# EAGLE design class_d_amplifier (EAGLE 9.6.2)
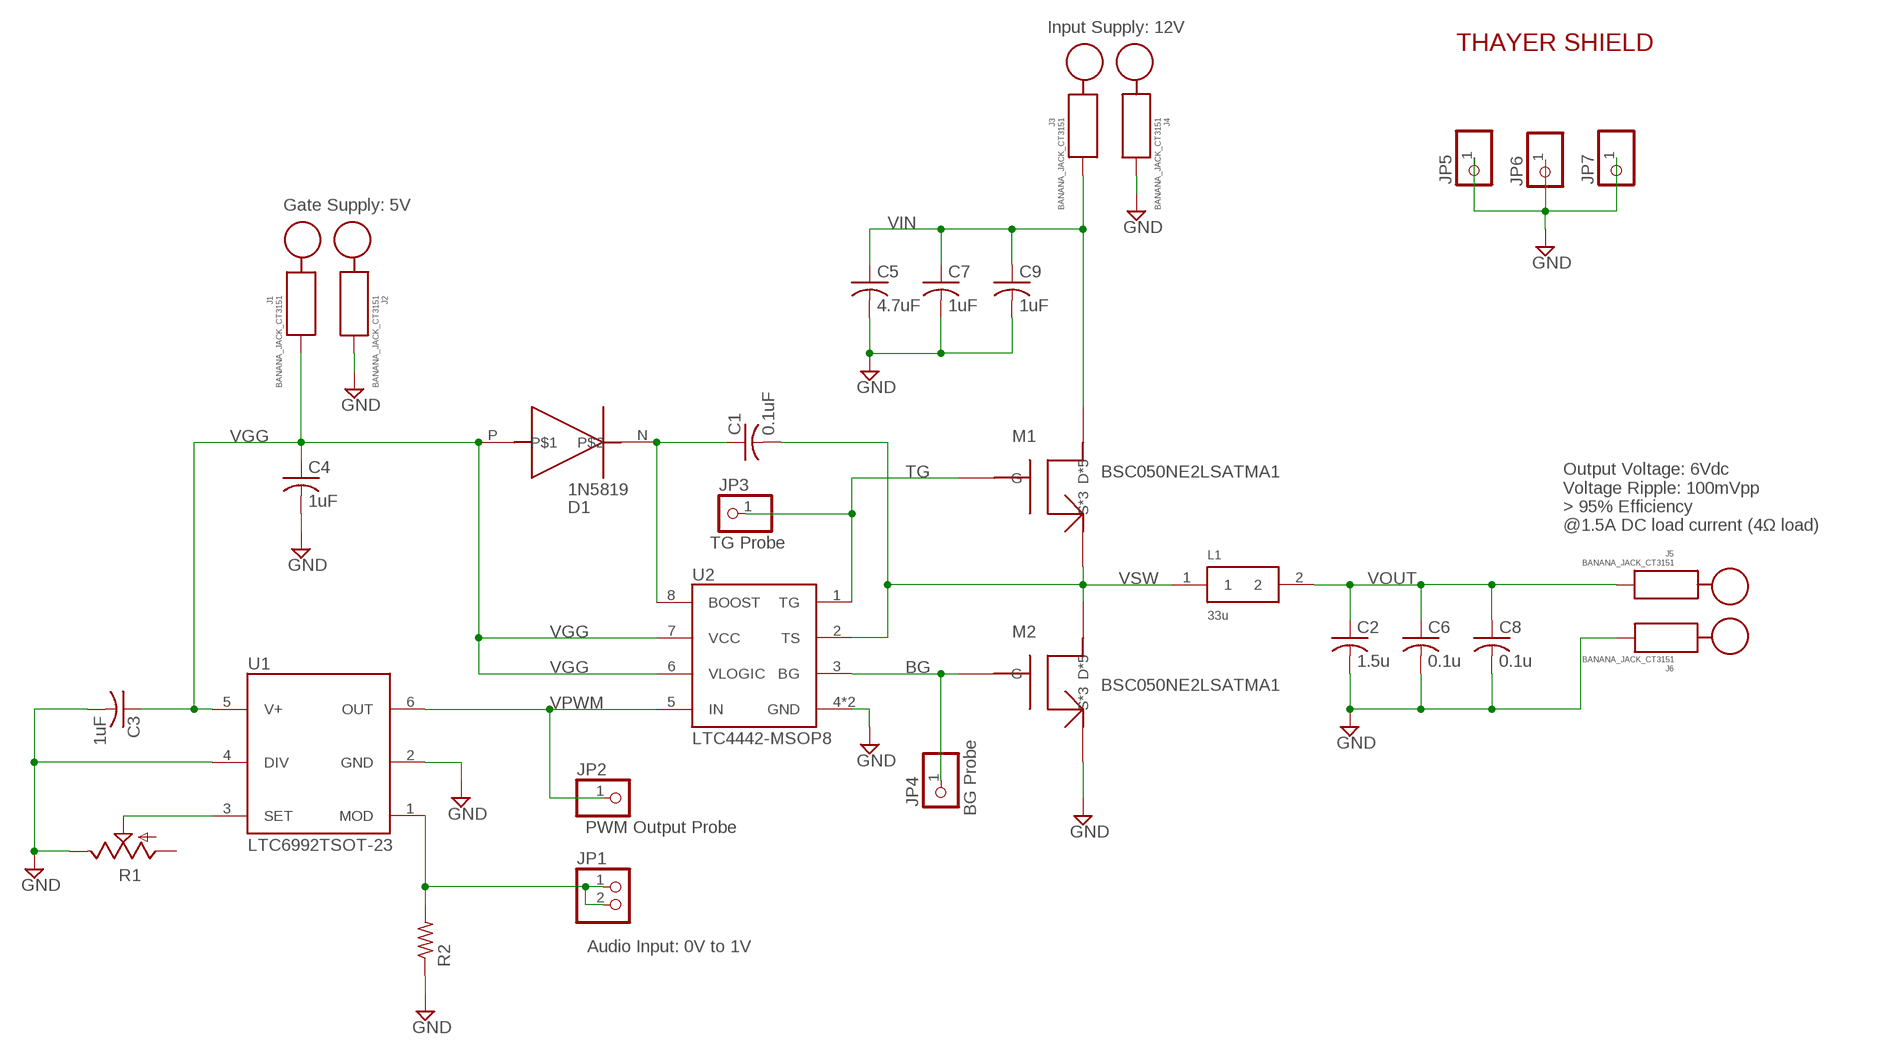
[diagram p0: schematic, sheet 1]

## Parts
C1  0.1uF  C-US  [C0805]
C2  1.5u  C-USC1206  [C1206]
C3  1uF  C-US  [C0805]
C4  1uF  C-US  [C0805]
C5  4.7uF  C-USC1206  [C1206]
C6  0.1u  C-US  [C0805]
C7  1uF  C-US  [C0805]
C8  0.1u  C-US  [C0805]
C9  1uF  C-US  [C0805]
D1  1N5819  DIODE  [SOD123]
J1  BANANA_JACK_CT3151  [CT3151SP2_PCB_MOUNT]
J2  BANANA_JACK_CT3151  [CT3151SP2_PCB_MOUNT]
J3  BANANA_JACK_CT3151  [CT3151SP2_PCB_MOUNT]
J4  BANANA_JACK_CT3151  [CT3151SP2_PCB_MOUNT]
J5  BANANA_JACK_CT3151  [CT3151SP2_PCB_MOUNT]
J6  BANANA_JACK_CT3151  [CT3151SP2_PCB_MOUNT]
JP1  PINHD-1X2  [1X02]
JP2  PINHD-1X1  [1X01]
JP3  PINHD-1X1  [1X01]
JP4  PINHD-1X1  [1X01]
JP5  PINHD-1X1  [1X01]
JP6  PINHD-1X1  [1X01]
JP7  PINHD-1X1  [1X01]
L1  33u  SER2900SER  [SER2900]
M1  BSC050NE2LSATMA1  [PD-TDSON-8]
M2  BSC050NE2LSATMA1  [PD-TDSON-8]
R1  TRIM_US-CT6  [CT6]
R2  R-US  [R0805]
U1  LTC6992TSOT-23  [TSOT23-6]
U2  LTC4442-MSOP8  LTC4442  [LTC4442]
U$1  THAYER  [THAYER]

## Nets
BG: JP4.1 M2.4(G) U2.3(BG)
BOOST: C1.1 D1.N U2.8(BOOST)
GND: C2.2 C3.2 C4.2 C5.2 C6.2 C7.2 C8.2 C9.2 J2.P$1(IN) J2.P$2(IN) J2.P$3(IN) J2.P$4(IN) J4.P$1(IN) J4.P$2(IN) J4.P$3(IN) J4.P$4(IN) J6.P$1(IN) J6.P$2(IN) J6.P$3(IN) J6.P$4(IN) JP5.1 JP6.1 JP7.1 M2.1(S*3) M2.2(S*3) M2.3(S*3) R1.E R2.1 U1.2(GND) U1.4(DIV) U2.4(GND) U2.9(GND)
N$1: R1.S U1.3(SET)
N$4: JP1.1 JP1.2 R2.2 U1.1(MOD)
TG: JP3.1 M1.4(G) U2.1(TG)
VGG: C3.1 C4.1 D1.P J1.P$1(IN) J1.P$2(IN) J1.P$3(IN) J1.P$4(IN) U1.5(V+) U2.6(VLOGIC) U2.7(VCC)
VIN: C5.1 C7.1 C9.1 J3.P$1(IN) J3.P$2(IN) J3.P$3(IN) J3.P$4(IN) M1.5(D*5) M1.6(D*5) M1.7(D*5) M1.8(D*5) M1.9(D*5)
VOUT: C2.1 C6.1 C8.1 J5.P$1(IN) J5.P$2(IN) J5.P$3(IN) J5.P$4(IN) L1.2
VPWM: JP2.1 U1.6(OUT) U2.5(IN)
VSW: C1.2 L1.1 M1.1(S*3) M1.2(S*3) M1.3(S*3) M2.5(D*5) M2.6(D*5) M2.7(D*5) M2.8(D*5) M2.9(D*5) U2.2(TS)
Unconnected: R1.A

## Notes on the sheet
- Input Supply: 12V
- Gate Supply: 5V
- Output Voltage: 6Vdc
  Voltage Ripple: 100mVpp
  > 95% Efficiency 
  @1.5A DC load current (4Ω load)
- TG Probe
- BG Probe
- PWM Output Probe
- Audio Input: 0V to 1V

## Library data of the parts
C1 C3 C4 C6-C9 = Engs125_library:C-US: 0805 capacitor footprint.
C2 C5 = rcl:C-US: CAPACITOR, American symbol; SPICEPREFIX: C
D1 = Engs125_library:DIODE: Diode with SOD123 package.
J1-J6 = Engs125_lib_UPDATEFeb22:BANANA_JACK_CT3151: This is a PCB mount banana jack for package CT3151SP-2
JP1 = Engs125_lib_UPDATEFeb22:PINHD-1X2: PIN HEADER
JP2-JP7 = Engs125_lib_UPDATEFeb22:PINHD-1X1: PIN HEADER
L1 = Engs125_library:SER2900: Inductor SER2900: http://www.coilcraft.com/ser2900.cfm
M1 M2 = Engs125_lib_NEW_UPDATE_USE_THIS_V2:BSC050NE2LSATMA1
R1 = Engs125_lib_UPDATEFeb22:TRIM_US-: POTENTIOMETER
R2 = Engs125_lib_UPDATEFeb22:R-US
U1 = Engs125_lib_UPDATEFeb22:LTC6992: LTC6992 is a silicon oscillator with an easy-to-use analog voltage-controlled pulse width modulation (PWM) capability.
U2 = Engs125_lib_NEW_UPDATE_USE_THIS_V2:LTC4442: LTC4442 (LTC4442-1) Synchronous N-channel Gate Driver Vcc = 6V - 9.5V Vin max = 38V
U$1 = Engs125_lib_UPDATEFeb22_with_logo:THAYER

## Board
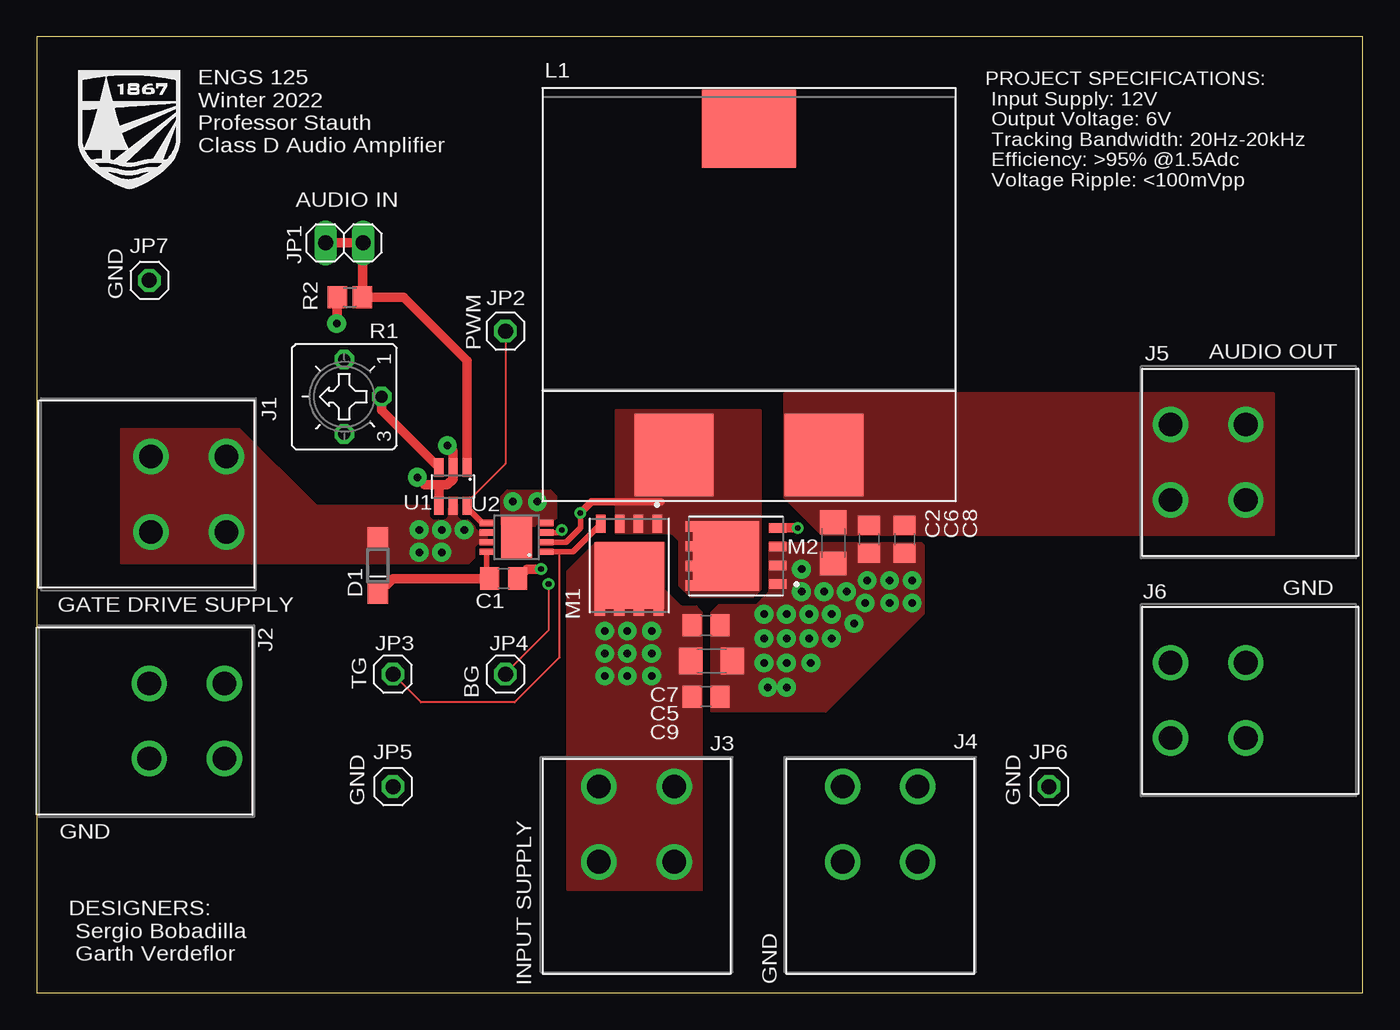
[diagram p1: board, top side]
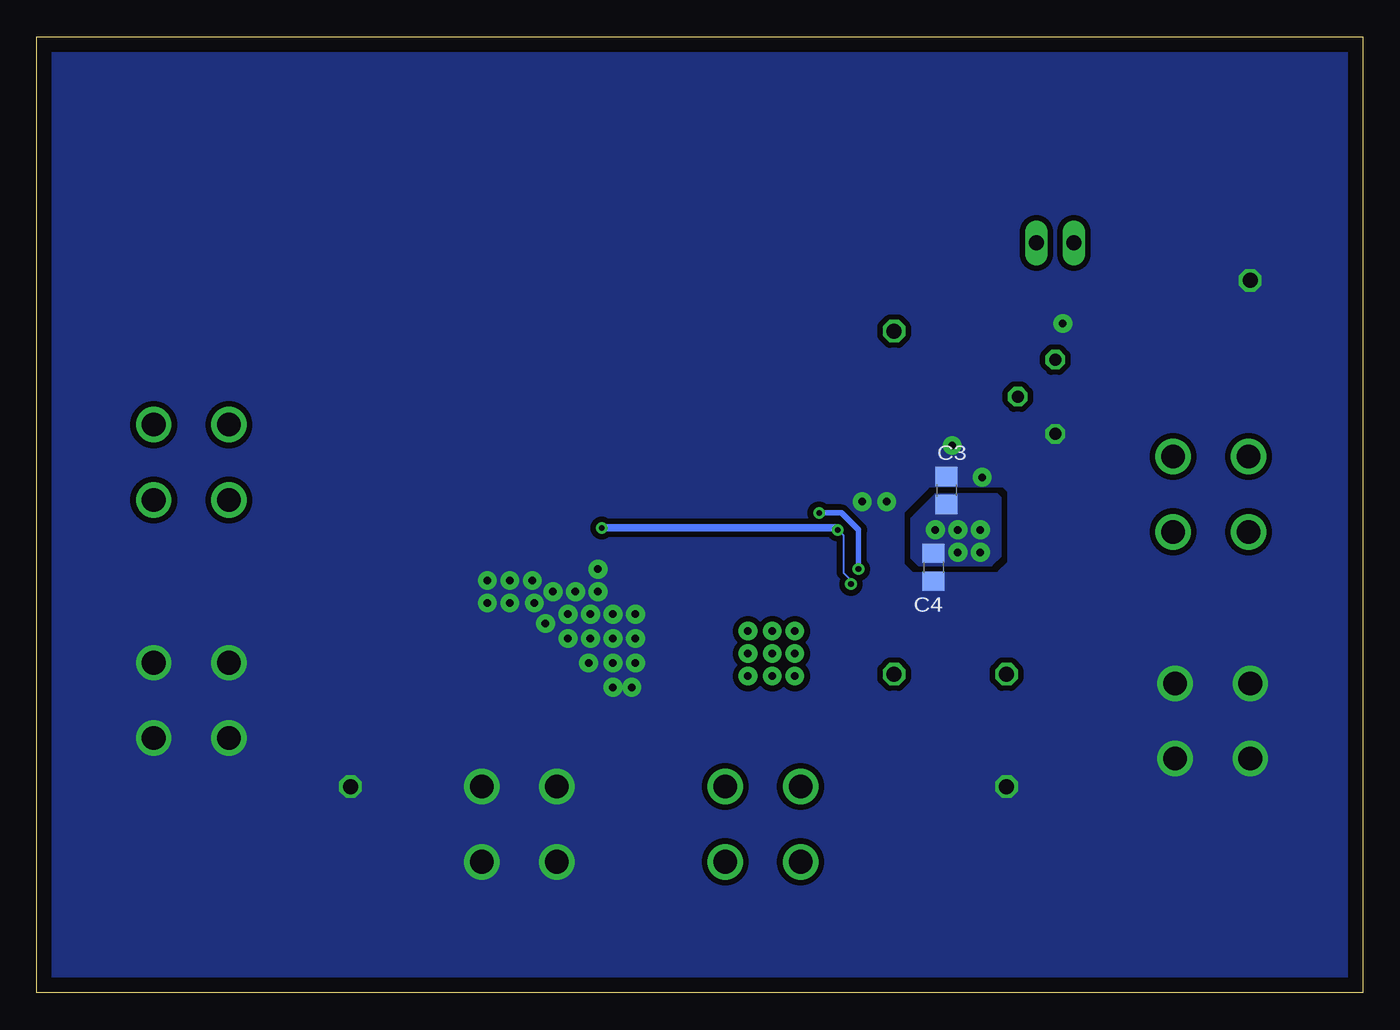
[diagram p2: board, bottom side, seen from below]

Size 89.84 x 64.76 mm. Coordinates in mm from the lower left corner, seen from the top.
Outline: 0,0 89.84,0 89.84,64.76 0,64.76 0,0
Copper layers (1*16): Top 0.035mm / dielectric 1.5mm / Bottom 0.035mm
Design rules "default *": minimum track width 6mil, minimum drill 15mil, track to track 6mil, track to pad 6mil, pad to pad 6mil, via to via 6mil, smd to smd 6mil, copper to edge 40mil, drill to drill 15mil, minimum pad ring 10mil, minimum via ring 8mil, stop-mask expansion 4mil, vias tented up to drill 0mil, thermal gap 10mil

### Footprints (pad centres in the part's own frame; a part is rotated, then mirrored left to right if it is on the bottom)
C0805 = smd 1.3 x 1.5: 1 -0.95,0; 2 0.95,0
C1206 = smd 1.6 x 1.8: 1 -1.4,0; 2 1.4,0
SOD123 = smd 1.4 x 1.4: N 1.9,0; P -1.9,0
CT3151SP2_PCB_MOUNT = drill 1.6: P$1 2.55,2.55; P$2 2.55,-2.55; P$3 -2.55,-2.55; P$4 -2.55,2.55
1X02 = drill 1.016 long: 1 -1.27,0; 2 1.27,0
1X01 = drill 1.016 octagon: 1 0,0
SER2900 = smd 5.334 x 5.588: 1 -5.08,-14.351; 2 5.08,-14.351 | smd 6.35 x 5.283: EXTRA 0,7.722
PD-TDSON-8 = smd 1.2 x 0.65: 1 -2.825,1.905; 2 -2.825,0.635; 3 -2.825,-0.635; 4 -2.825,-1.905 | smd 0.5 x 0.7: 5 3.175,-1.995; 6 3.175,-0.665; 7 3.175,0.665; 8 3.175,1.995 | smd 4.5 x 4.7: 9 0.675,0
CT6 = drill 0.813 octagon: A 2.515,0; E -2.515,0; S 0,-2.54
R0805 = smd 1.3 x 1.5: 1 -0.85,0; 2 0.85,0
TSOT23-6 = smd 0.62 x 1.22: 1 -0.95,-1.3; 2 0,-1.3; 3 0.95,-1.3; 4 0.95,1.3; 5 0,1.3; 6 -0.95,1.3
LTC4442 = smd 0.42 x 0.9: 1 -0.975,-2.05; 2 -0.325,-2.05; 3 0.325,-2.05; 4 0.975,-2.05; 5 0.975,2.05; 6 0.325,2.05; 7 -0.325,2.05; 8 -0.975,2.05 | smd 2.794 x 2.083: 9 0,0

### Placement (x,y rotation side)
C1  31.62,28.07 0 top
C2  53.98,30.48 270 top
C3  28.19,34.04 90 bottom
C4  29.08,28.83 270 bottom
C5  45.72,22.48 0 top
C6  56.39,30.73 270 top
C7  45.34,24.89 0 top
C8  58.8,30.73 270 top
C9  45.34,20.07 0 top
D1  23.11,28.96 270 top
J1  10.29,33.78 0 top
J2  10.16,18.41 0 top
J3  40.64,11.43 90 top
J4  57.15,11.43 90 top
J5  79.38,35.94 180 top
J6  79.38,19.81 180 top
JP1  20.83,50.8 180 top
JP2  31.75,44.83 0 top
JP3  24.13,21.59 180 top
JP4  31.75,21.59 0 top
JP5  24.13,13.97 0 top
JP6  68.58,13.97 0 top
JP7  7.62,48.26 0 top
L1  48.26,50.8 0 top
M1  40.13,28.96 270 top
M2  47.37,29.59 180 top
R1  20.83,40.39 90 top
R2  21.21,47.12 0 top
U1  28.19,34.29 180 top
U2  32.51,30.86 90 top
U$1  2.79,54.48 0 top

### Tracks (layer width: path | path; a pad name or v marks a point on that pad's centre or on a via)
BG  (via drill 0.38, 0.38 pad 0.76)
  Top 0.152: JP4.1 31.75,21.64 34.67,24.56 v34.67,27.69
  Top 0.381: U2.3 35.38,31.19 v35.56,31.37
  Top 0.635: M2.4 v51.56,31.5
  Bottom 0.152: v35.56,31.37 35.18,30.99 35.18,28.45 34.67,27.94 v34.67,27.69
  Bottom 0.508: v51.56,31.5 35.69,31.5 v35.56,31.37
BOOST
  Top 0.381: U2.8 30.46,28.28 C1.1
  Top 0.635: C1.1 24.12,28.07 D1.N
GND  (via drill 0.51 pad 1.27)
  Top 0.635: R2.1 20.36,45.38 v20.32,45.34 | 27.3,34.42 27.81,34.42 28.19,34.8 U1.2 28.19,36.7 v27.81,37.08 | 27.3,34.42 26.29,34.42 v25.78,34.92 | U1.4 27.24,34.36 27.3,34.42
  other vias: 59.31,27.94 57.78,27.94 56.26,27.94 51.82,28.7 59.31,26.42 57.78,26.42 56.13,26.42 54.86,27.18 50.8,22.35 49.28,22.35 50.8,24 49.28,24 50.8,25.65 49.28,25.65 53.34,27.18 52.32,25.65 53.85,25.65 51.82,27.18 50.8,20.7 49.53,20.7 52.32,24 53.85,24 52.45,22.35 55.37,25.02 32.26,33.27 33.91,33.27
  pour Top (isolate 0.381, no thermals): 60.07,30.35 60.07,25.65 53.47,19.05 45.72,19.05 45.72,25.78 46.23,26.29 48.77,26.29 49.66,27.18 49.66,30.48 59.94,30.48
  pour Bottom (isolate 0.381, rank 2, no thermals): 0,64.77 89.92,64.77 89.92,0 0,0
  pour Top (isolate 0.381, no thermals): 31.5,31.75 31.5,33.66 31.88,34.04 34.8,34.04 35.18,33.66 35.18,31.88 34.92,31.62 31.62,31.62
N$1
  Top 0.635: U1.3 23.37,39.47 R1.S
N$4
  Top 0.635: U1.1 29.14,42.83 24.86,47.12 R2.2 22.06,50.76 JP1.1 JP1.2
TG
  Top 0.152: JP3.1 26.04,19.68 32.38,19.68 35.43,22.73 35.43,29.89
  Top 0.381: U2.1 35.43,29.89 36.33,29.89
  Top 0.406: 36.33,29.89 M1.4
VGG  (via drill 0.51 pad 1.27)
  other vias: 25.91,31.37 28.96,31.37 27.43,31.37 25.91,29.84 27.43,29.84
  pour Top (isolate 0.305, no thermals): 5.71,29.08 5.71,38.23 13.72,38.23 18.92,33.02 30.48,33.02 30.48,30.35 29.21,29.08
  pour Bottom (isolate 0.305, no thermals): 24.51,29.59 24.51,33.53 24.77,33.78 28.96,33.78 30.61,32.13 30.61,29.46 30.1,28.96 25.15,28.96
VIN  (via drill 0.51 pad 1.27)
  other vias: 41.66,24.51 40.01,24.51 38.48,24.51 41.66,22.99 40.01,22.99 38.48,22.99 41.66,21.46 40.01,21.46 38.48,21.46
  pour Top (no thermals): 35.94,6.99 45.09,6.99 45.09,25.78 44.7,26.16 43.69,26.16 42.55,27.3 42.55,30.48 37.85,30.48 35.94,28.57
VOUT
  pour Top (isolate 0.381, no thermals): 50.67,33.53 50.67,40.64 83.82,40.64 83.82,30.99 53.21,30.99
VPWM
  Top 0.152: JP2.1 31.75,35.85 29.14,33.24 U1.6
  Top 0.381: U2.5 30.17,31.84 29.14,32.86 U1.6
VSW  (via drill 0.38, 0.38 pad 0.76)
  Top 0.381: U2.2 35.87,30.54 36.83,31.5 v36.83,32.51
  Top 0.508: 42.29,33.27 37.59,33.27 v36.83,32.51
  Top 0.635: C1.2 33.21,28.7 v34.16,28.7
  Bottom 0.381: v34.16,28.7 34.16,31.37 35.31,32.51 v36.83,32.51
  pour Top (no thermals): 39.24,31.11 39.24,39.5 49.02,39.5 49.02,27.3 48.51,26.8 44.32,26.8 43.56,27.56 43.56,30.61 43.05,31.11

### Text on the board
tPlace: ENGS 125 / Winter 2022 / Professor Stauth / Class D Audio Amplifier | PROJECT SPECIFICATIONS: / Input Supply: 12V / Output Voltage: 6V / Tracking Bandwidth: 20Hz-20kHz / Efficiency: >95% @1.5Adc / Voltage Ripple: <100mVpp | AUDIO IN | GND | PWM | AUDIO OUT | GND | GATE DRIVE SUPPLY | BG | TG | GND | GND | INPUT SUPPLY | GND | GND | DESIGNERS: / Sergio Bobadilla / Garth Verdeflor